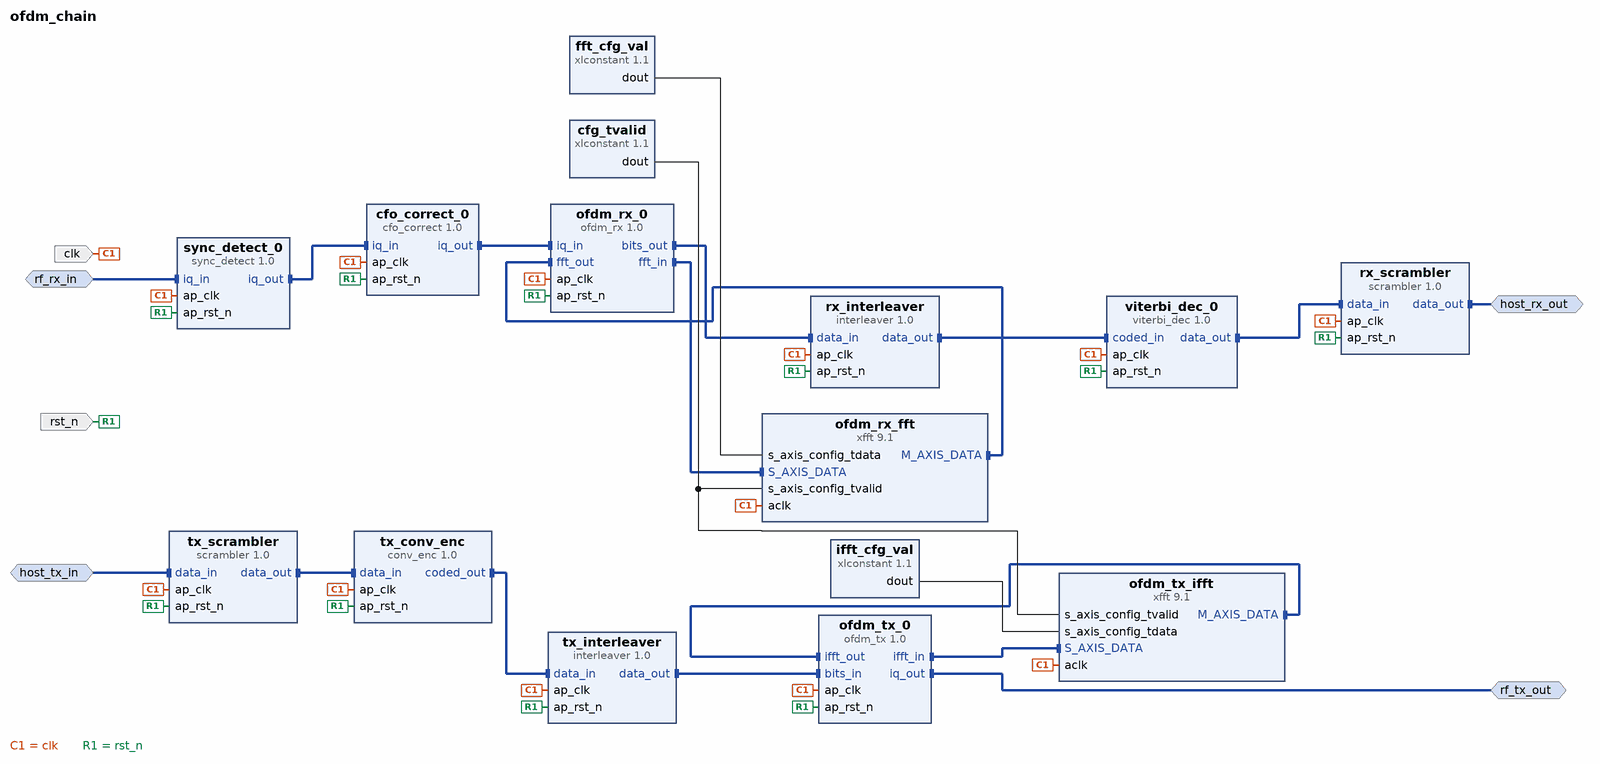
[diagram p0: block diagram of the top level]
# Vivado block design ofdm_chain, xc7a50tcsg325-2, Vivado 2025.2
create_bd_design ofdm_chain

create_bd_intf_port -mode Slave -vlnv xilinx.com:interface:axis_rtl:1.0 host_tx_in
set_property -dict [list \
  CONFIG.HAS_TKEEP 0 \
  CONFIG.HAS_TLAST 0 \
  CONFIG.HAS_TREADY 1 \
  CONFIG.HAS_TSTRB 0 \
  CONFIG.LAYERED_METADATA undef \
  CONFIG.TDATA_NUM_BYTES 1 \
  CONFIG.TDEST_WIDTH 0 \
  CONFIG.TID_WIDTH 0 \
  CONFIG.TUSER_WIDTH 0 \
] [get_bd_intf_ports host_tx_in]
create_bd_intf_port -mode Master -vlnv xilinx.com:interface:axis_rtl:1.0 rf_tx_out
create_bd_intf_port -mode Slave -vlnv xilinx.com:interface:axis_rtl:1.0 rf_rx_in
set_property -dict [list \
  CONFIG.HAS_TKEEP 0 \
  CONFIG.HAS_TLAST 0 \
  CONFIG.HAS_TREADY 1 \
  CONFIG.HAS_TSTRB 0 \
  CONFIG.LAYERED_METADATA undef \
  CONFIG.TDATA_NUM_BYTES 6 \
  CONFIG.TDEST_WIDTH 0 \
  CONFIG.TID_WIDTH 0 \
  CONFIG.TUSER_WIDTH 0 \
] [get_bd_intf_ports rf_rx_in]
create_bd_intf_port -mode Master -vlnv xilinx.com:interface:axis_rtl:1.0 host_rx_out
create_bd_port -dir I -type clk clk
set_property -dict {CONFIG.FREQ_HZ 100000000} [get_bd_ports clk]
create_bd_port -dir I rst_n

create_bd_cell -type ip -vlnv hallycon.in:ofdm:scrambler:1.0 tx_scrambler
create_bd_cell -type ip -vlnv hallycon.in:ofdm:conv_enc:1.0 tx_conv_enc
create_bd_cell -type ip -vlnv hallycon.in:ofdm:interleaver:1.0 tx_interleaver
create_bd_cell -type ip -vlnv hallycon.in:ofdm:ofdm_tx:1.0 ofdm_tx_0
create_bd_cell -type ip -vlnv hallycon.in:ofdm:sync_detect:1.0 sync_detect_0
create_bd_cell -type ip -vlnv hallycon.in:ofdm:cfo_correct:1.0 cfo_correct_0
create_bd_cell -type ip -vlnv hallycon.in:ofdm:ofdm_rx:1.0 ofdm_rx_0
create_bd_cell -type ip -vlnv hallycon.in:ofdm:interleaver:1.0 rx_interleaver
create_bd_cell -type ip -vlnv hallycon.in:ofdm:viterbi_dec:1.0 viterbi_dec_0
create_bd_cell -type ip -vlnv hallycon.in:ofdm:scrambler:1.0 rx_scrambler
create_bd_cell -type ip -vlnv xilinx.com:ip:xfft:9.1 ofdm_tx_ifft
set_property -dict [list \
  CONFIG.implementation_options pipelined_streaming_io \
  CONFIG.output_ordering natural_order \
  CONFIG.run_time_configurable_transform_length false \
  CONFIG.transform_length 256 \
] [get_bd_cells ofdm_tx_ifft]
create_bd_cell -type ip -vlnv xilinx.com:ip:xfft:9.1 ofdm_rx_fft
set_property -dict [list \
  CONFIG.implementation_options pipelined_streaming_io \
  CONFIG.output_ordering natural_order \
  CONFIG.run_time_configurable_transform_length false \
  CONFIG.transform_length 256 \
] [get_bd_cells ofdm_rx_fft]
create_bd_cell -type ip -vlnv xilinx.com:ip:xlconstant:1.1 ifft_cfg_val
set_property -dict {CONFIG.CONST_VAL 340 CONFIG.CONST_WIDTH 16} [get_bd_cells ifft_cfg_val]
create_bd_cell -type ip -vlnv xilinx.com:ip:xlconstant:1.1 fft_cfg_val
set_property -dict {CONFIG.CONST_VAL 341 CONFIG.CONST_WIDTH 16} [get_bd_cells fft_cfg_val]
create_bd_cell -type ip -vlnv xilinx.com:ip:xlconstant:1.1 cfg_tvalid
set_property -dict {CONFIG.CONST_VAL 1 CONFIG.CONST_WIDTH 1} [get_bd_cells cfg_tvalid]

# ---- connections ----

connect_bd_intf_net [get_bd_intf_pins cfo_correct_0/iq_out] [get_bd_intf_pins ofdm_rx_0/iq_in]
connect_bd_intf_net [get_bd_intf_ports host_tx_in] [get_bd_intf_pins tx_scrambler/data_in]
connect_bd_intf_net [get_bd_intf_pins ofdm_rx_0/bits_out] [get_bd_intf_pins rx_interleaver/data_in]
connect_bd_intf_net [get_bd_intf_pins ofdm_rx_0/fft_in] [get_bd_intf_pins ofdm_rx_fft/S_AXIS_DATA]
connect_bd_intf_net [get_bd_intf_pins ofdm_rx_fft/M_AXIS_DATA] [get_bd_intf_pins ofdm_rx_0/fft_out]
connect_bd_intf_net [get_bd_intf_pins ofdm_tx_0/ifft_in] [get_bd_intf_pins ofdm_tx_ifft/S_AXIS_DATA]
connect_bd_intf_net [get_bd_intf_ports rf_tx_out] [get_bd_intf_pins ofdm_tx_0/iq_out]
connect_bd_intf_net [get_bd_intf_pins ofdm_tx_ifft/M_AXIS_DATA] [get_bd_intf_pins ofdm_tx_0/ifft_out]
connect_bd_intf_net [get_bd_intf_ports rf_rx_in] [get_bd_intf_pins sync_detect_0/iq_in]
connect_bd_intf_net [get_bd_intf_pins rx_interleaver/data_out] [get_bd_intf_pins viterbi_dec_0/coded_in]
connect_bd_intf_net [get_bd_intf_ports host_rx_out] [get_bd_intf_pins rx_scrambler/data_out]
connect_bd_intf_net [get_bd_intf_pins sync_detect_0/iq_out] [get_bd_intf_pins cfo_correct_0/iq_in]
connect_bd_intf_net [get_bd_intf_pins tx_conv_enc/coded_out] [get_bd_intf_pins tx_interleaver/data_in]
connect_bd_intf_net [get_bd_intf_pins tx_interleaver/data_out] [get_bd_intf_pins ofdm_tx_0/bits_in]
connect_bd_intf_net [get_bd_intf_pins tx_scrambler/data_out] [get_bd_intf_pins tx_conv_enc/data_in]
connect_bd_intf_net [get_bd_intf_pins viterbi_dec_0/data_out] [get_bd_intf_pins rx_scrambler/data_in]
connect_bd_net [get_bd_pins cfg_tvalid/dout] [get_bd_pins ofdm_tx_ifft/s_axis_config_tvalid] [get_bd_pins ofdm_rx_fft/s_axis_config_tvalid]
connect_bd_net [get_bd_ports clk] \
  [get_bd_pins tx_scrambler/ap_clk] [get_bd_pins tx_conv_enc/ap_clk] [get_bd_pins tx_interleaver/ap_clk] \
  [get_bd_pins ofdm_tx_0/ap_clk] [get_bd_pins sync_detect_0/ap_clk] [get_bd_pins cfo_correct_0/ap_clk] \
  [get_bd_pins ofdm_rx_0/ap_clk] [get_bd_pins rx_interleaver/ap_clk] [get_bd_pins viterbi_dec_0/ap_clk] \
  [get_bd_pins rx_scrambler/ap_clk] [get_bd_pins ofdm_tx_ifft/aclk] [get_bd_pins ofdm_rx_fft/aclk]
connect_bd_net [get_bd_pins fft_cfg_val/dout] [get_bd_pins ofdm_rx_fft/s_axis_config_tdata]
connect_bd_net [get_bd_pins ifft_cfg_val/dout] [get_bd_pins ofdm_tx_ifft/s_axis_config_tdata]
connect_bd_net [get_bd_ports rst_n] \
  [get_bd_pins tx_scrambler/ap_rst_n] [get_bd_pins tx_conv_enc/ap_rst_n] [get_bd_pins tx_interleaver/ap_rst_n] \
  [get_bd_pins ofdm_tx_0/ap_rst_n] [get_bd_pins sync_detect_0/ap_rst_n] [get_bd_pins cfo_correct_0/ap_rst_n] \
  [get_bd_pins ofdm_rx_0/ap_rst_n] [get_bd_pins rx_interleaver/ap_rst_n] [get_bd_pins viterbi_dec_0/ap_rst_n] \
  [get_bd_pins rx_scrambler/ap_rst_n]

validate_bd_design
save_bd_design
